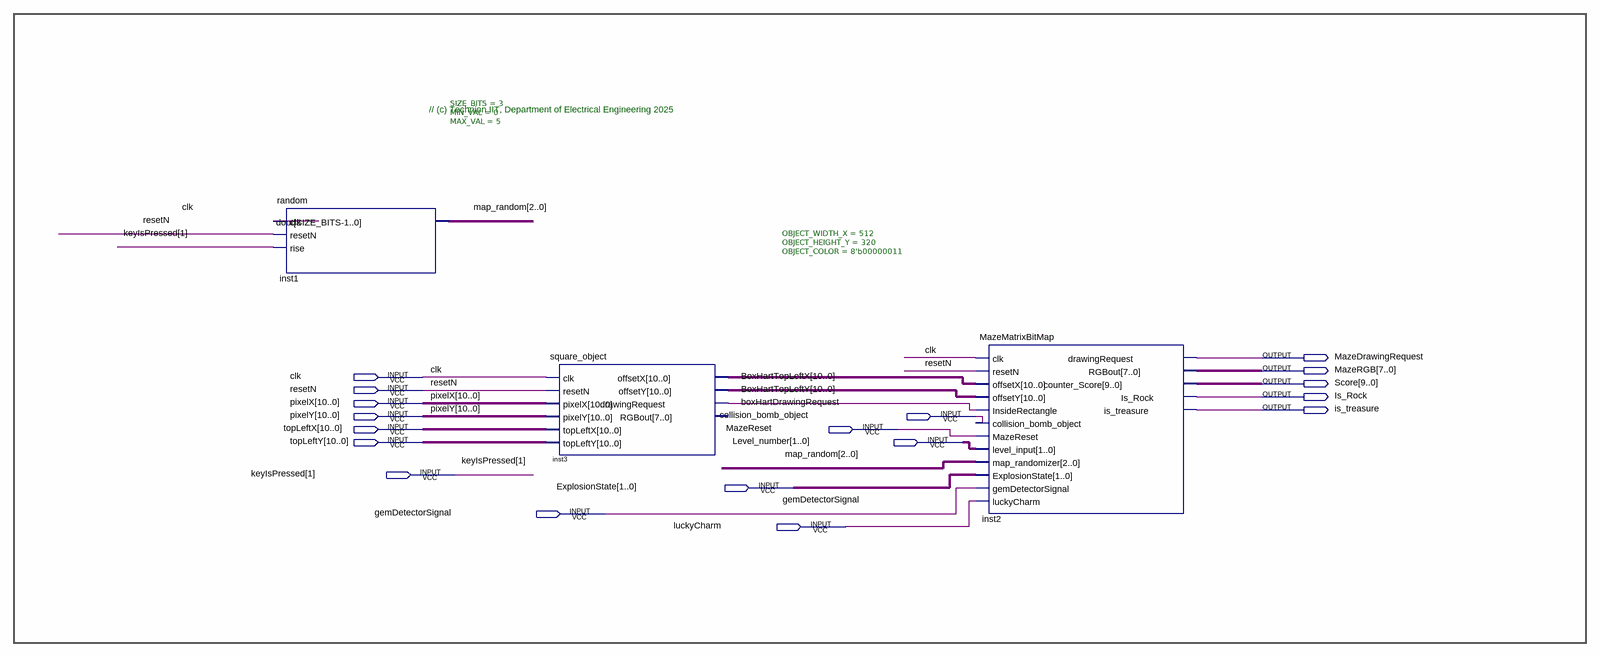
[diagram p0: schematic sheet]
// Quartus schematic OBJECT_DISPLAY.bdf as structural Verilog: 3 symbols, 18 pins
module OBJECT_DISPLAY (
  input  clk,
  input  resetN,
  input  [10:0] pixelX,
  input  [10:0] pixelY,
  input  collision_bomb_object,
  input  [10:0] topLeftX,
  input  MazeReset,
  input  [10:0] topLeftY,
  input  [1:0] Level_number,
  input  [1:1] keyIsPressed,
  input  [1:0] ExplosionState,
  input  gemDetectorSignal,
  input  luckyCharm,
  output MazeDrawingRequest,
  output [7:0] MazeRGB,
  output [9:0] Score,
  output Is_Rock,
  output is_treasure
);

  wire boxHartDrawingRequest;
  wire [2:0] map_random;
  wire [10:0] BoxHartTopLeftX, BoxHartTopLeftY;

  random #(.SIZE_BITS(3), .MIN_VAL(0), .MAX_VAL(5)) inst1 (
    .clk(clk), .resetN(resetN), .rise(keyIsPressed[1]), .dout(map_random));
  square_object #(.OBJECT_WIDTH_X(512), .OBJECT_HEIGHT_Y(320), .OBJECT_COLOR(8'b00000011)) inst3 (
    .clk(clk), .resetN(resetN), .pixelX(pixelX), .pixelY(pixelY), .topLeftX(topLeftX), .topLeftY(topLeftY),
    .offsetX(BoxHartTopLeftX), .offsetY(BoxHartTopLeftY), .drawingRequest(boxHartDrawingRequest));  // open: RGBout
  MazeMatrixBitMap inst2 (
    .clk(clk), .resetN(resetN), .offsetX(BoxHartTopLeftX), .offsetY(BoxHartTopLeftY),
    .InsideRectangle(boxHartDrawingRequest), .collision_bomb_object(collision_bomb_object),
    .MazeReset(MazeReset), .level_input(Level_number), .map_randomizer(map_random),
    .ExplosionState(ExplosionState), .gemDetectorSignal(gemDetectorSignal), .luckyCharm(luckyCharm),
    .drawingRequest(MazeDrawingRequest), .RGBout(MazeRGB), .counter_Score(Score), .Is_Rock(Is_Rock),
    .is_treasure(is_treasure));

  // Notes on the sheet:
  //   // (c) Technion IIT, Department of Electrical Engineering 2025
endmodule
